# Altium schematic sheet Uc_Ticketing_Slave.SchDoc
size A4; Organization: ETML-ES; Address1: Avenue Recordon 1; Address2: 1004 Lausanne; Address3: Switzerland
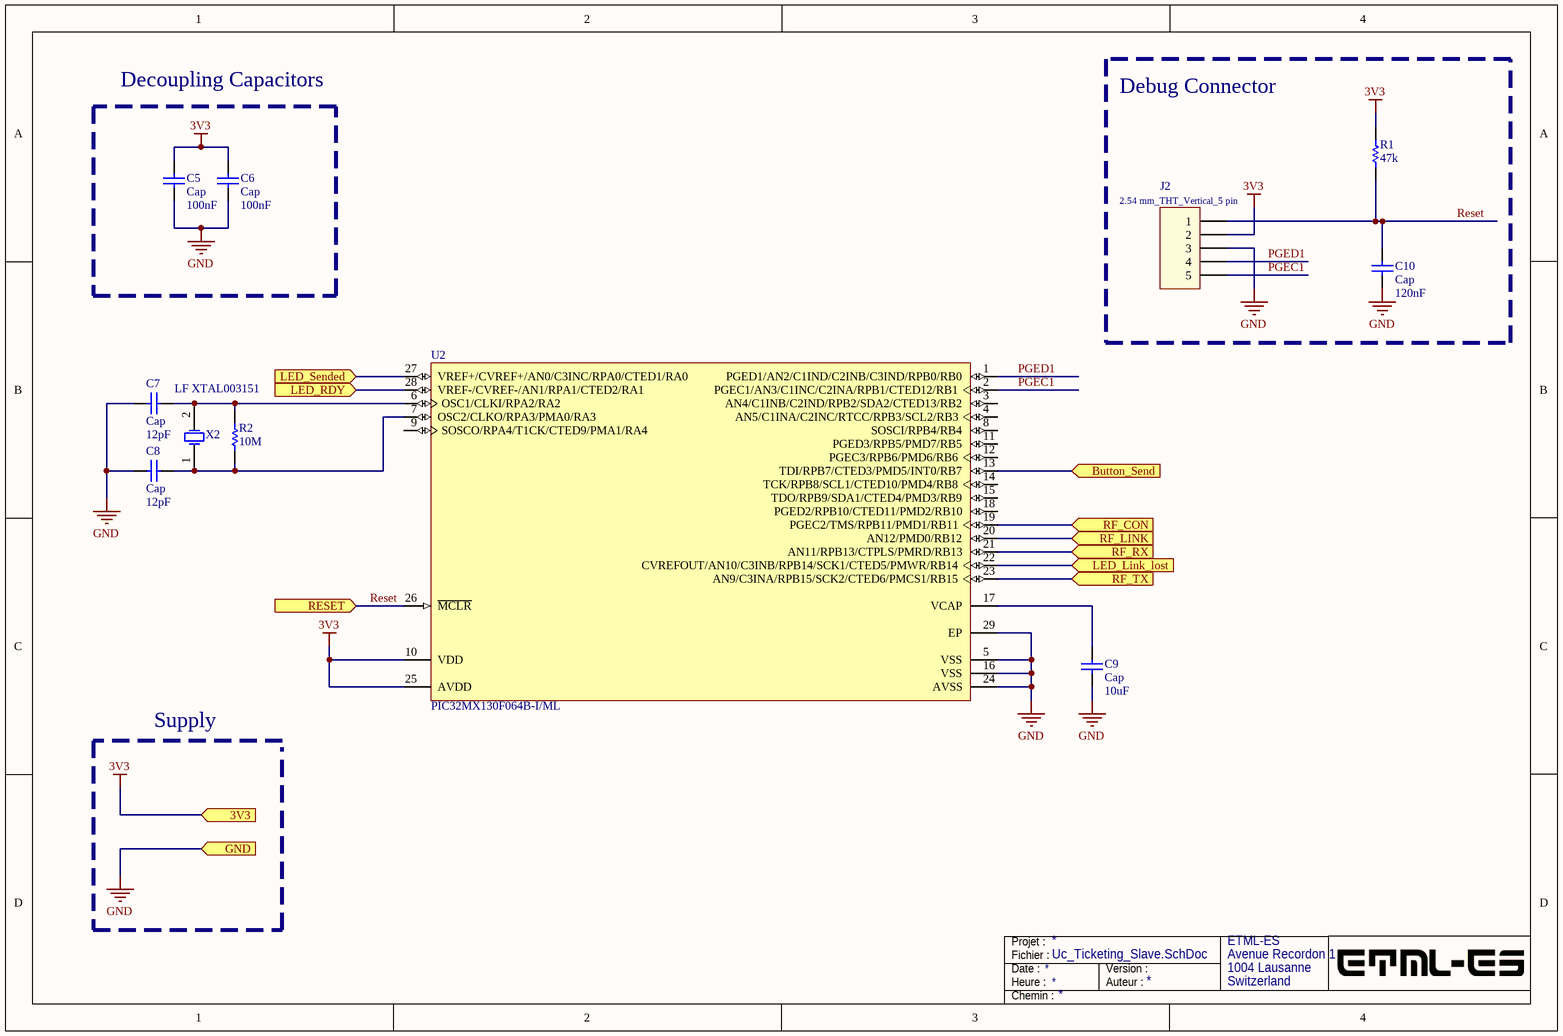
[diagram p0: Uc_Ticketing_Slave.SchDoc]

## Parts
C5  Cap  value 100nF  [6-0805_N]
C6  Cap  value 100nF  [6-0805_N]
C7  Cap  value 12pF  [6-0805_N]
C8  Cap  value 12pF  [6-0805_N]
C9  Cap  value 10uF  [6-0805_N]
C10  Cap  value 120nF  [6-0805_N]
J2  2.54 mm_THT_Vertical_5 pin  [61300511121]
R1  47k  [RESC0805(2012)_L]
R2  10M  [RESC0805(2012)_L]
U2  PIC32MX130F064B-I/ML  [MCHP-QFN-ML28_L]
X2  LF XTAL003151  [ECS-80-18-5PX-TR_V]

## Blocks framed on the sheet
Debug Connector: C10 J2 R1
Decoupling Capacitors: C5 C6

## Ports
3V3, Button_Send, GND, LED_Link_lost, LED_RDY, LED_Sended, RESET, RF_CON, RF_LINK, RF_RX, RF_TX

## Nets
3V3: C5.2 C6.2 J2.2 R1.1 U2.10(VDD) U2.25(AVDD) ; port 3V3
GND: C5.1 C6.1 C7.1 C8.2 C9.1 C10.1 J2.3 U2.5(VSS) U2.16(VSS) U2.24(AVSS) U2.29(EP) ; port GND
Button_Send: U2.13(TDI/RPB7/CTED3/PMD5/INT0/RB7) ; port Button_Send
LED_Link_lost: U2.22(CVREFOUT/AN10/C3INB/RPB14/SCK1/CTED5/PMWR/RB14) ; port LED_Link_lost
LED_RDY: U2.28(VREF-/CVREF-/AN1/RPA1/CTED2/RA1) ; port LED_RDY
LED_Sended: U2.27(VREF+/CVREF+/AN0/C3INC/RPA0/CTED1/RA0) ; port LED_Sended
PGEC1: J2.5 U2.2(PGEC1/AN3/C1INC/C2INA/RPB1/CTED12/RB1)
PGED1: J2.4 U2.1(PGED1/AN2/C1IND/C2INB/C3IND/RPB0/RB0)
Reset: C10.2 J2.1 R1.2 U2.26(~{MCLR}) ; port RESET
RF_CON: U2.19(PGEC2/TMS/RPB11/PMD1/RB11) ; port RF_CON
RF_LINK: U2.20(AN12/PMD0/RB12) ; port RF_LINK
RF_RX: U2.21(AN11/RPB13/CTPLS/PMRD/RB13) ; port RF_RX
RF_TX: U2.23(AN9/C3INA/RPB15/SCK2/CTED6/PMCS1/RB15) ; port RF_TX
NetC7_2: C7.2 R2.2 U2.6(OSC1/CLKI/RPA2/RA2) X2.2(X2)
NetC8_1: C8.1 R2.1 U2.7(OSC2/CLKO/RPA3/PMA0/RA3) X2.1(X1)
NetC9_2: C9.2 U2.17(VCAP)

Not connected (* = marked no-connect by the designer): U2 3(AN4/C1INB/C2IND/RPB2/SDA2/CTED13/RB2) 4(AN5/C1INA/C2INC/RTCC/RPB3/SCL2/RB3) 8(SOSCI/RPB4/RB4) 9(SOSCO/RPA4/T1CK/CTED9/PMA1/RA4) 11(PGED3/RPB5/PMD7/RB5) 12(PGEC3/RPB6/PMD6/RB6) 14(TCK/RPB8/SCL1/CTED10/PMD4/RB8) 15(TDO/RPB9/SDA1/CTED4/PMD3/RB9) 18(PGED2/RPB10/CTED11/PMD2/RB10)

## Notes on the sheet
- Supply
- Fichier :
- Date :
- Heure :
- Projet :
- Auteur :
- Version :
- Chemin :

## Library data of the parts
C5-C10 = Cap: Capacitor; Published: 8-Jun-2000; LatestRevisionDate: 17-Jul-2002; LatestRevisionNote: Re-released for DXP Platform.; PackageReference: RAD-0.3; Publisher: Altium Limited; PackageDescription: Radial Cap, Thru-Hole; 2 Leads; 0.3 in Pin Spacing
J2 = 61300511121: Pin Header WR-PHD, pitch 2.54 mm, THT, Vertical, single row, 5 pin; Rated Current: 3 A; Pin Number: 5; Pitch: 2.54 mm; Working Voltage: 250 VAC; Contact Resistance: 20 mOhm; Insulation Resistance: >1000 MOhm; ComponentLink1Description: Manufacturer; ComponentLink1URL: http://www.we-online.de; ComponentLink2Description: Datasheet; ComponentLink2URL: http://katalog.we-online.de/em/datasheet/6130xx11121.pdf; Part Number: 61300511121; Published Date: Jan. 2018; Publisher: Wurth Elektronik; Operating Temperature: -40 to 105 degC; Mounting Technology: THT; Row Number: Single; Orientation: Vertical
R1 = CMP-1013-00122-1: 100K 0.125W 5% 0805 (2012 Metric)  SMD; Case-Metric: 2012; Case-EIA: 0805; Tolerance: 5 %; Technology: SMT; Value: 47k; Power: 0.125 W
R2 = CMP-1013-00122-1: 100K 0.125W 5% 0805 (2012 Metric)  SMD; Case-Metric: 2012; Value: 47k; Case-EIA: 0805; Tolerance: 5 %; Technology: SMT; Power: 0.125 W
U2 = CMP-0048-00437-1: 32-bit Microcontroller with Audio and Graphics Interface, USB and Advanced Analog, 40 MHz, 21 I/O, PMP, -40 to 85 degC, 28-pin QFN (ML28), Tube; Manufacturer: Microchip; PackageReference: QFN-ML28; ComponentLink1URL: http://www.microchip.com; ComponentLink2URL: http://ww1.microchip.com/downloads/en/DeviceDoc/61168E.pdf; PartNumber: PIC32MX130F064B-I/ML; ComponentLink3URL: http://www.microchip.com/stellent/groups/techpub_sg/documents/packagingspec/en012702.pdf; ComponentLink4Description: Product URL; PackageVersion: C04-105C; PackageDescription: 28-Lead Plastic Quad Flat, 6 x 6 mm Body, 0.65 mm Pitch; Mounting Technology: Surface Mount; ComponentLink3Description: Package Specification; ComponentLink2Description: Datasheet; DatasheetVersion: Rev. E; ComponentLink1Description: Manufacturer URL; ComponentLink4URL: http://www.microchip.com/PIC32MX130F064B
X2 = CMP-2000-06193-1: Low Profile Quartz Crystal, 8.0 MHz, 2-Pin SMD, RoHS, Tape and Reel; Brand: ECS; Tolerance: 30PPM; Case Height: 4.3mm; Frequency: 8MHz; Frequency Stability: 50PPM; Case Length: 13.2mm; Case Width: 4.8mm; Load Capacitance: 18pF; Termination Style: SMD/SMT; Product Category: Crystals; Packaging: Reel; Package Reference: ECS-80-18-5PX-TR; Mounting Technology: SurfaceMount; Dimensions: 4.8mmWx13.2mmLx4.3mmH; Package Description: 2-Pin Surface Mount Device, Body 11.4 x 4.8 mm, Height 4.3 mm; Datasheet URL: https://www.ecsxtal.com/store/pdf/csm-7x.pdf; Datasheet Version: 05/2016; Manufacturer: ECS; Factory Pack Quantity: 1000; Manufacturer URL: https://www.ecsxtal.com/; Type: SMDQuartzCrystals; Mounting Style: SMD/SMT; Package / Case: HC-49/US; Operating Temperature Range: -10Cto+70C; RoHS: Details; Series: CSM-7X